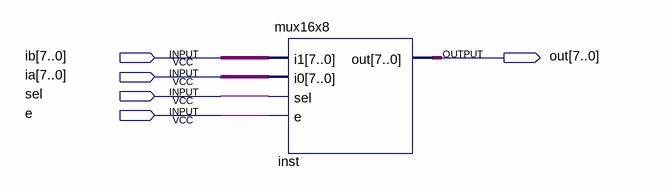
[diagram p0: schematic sheet]
// Quartus schematic Testemux16x8.bdf as structural Verilog: 1 symbols, 5 pins
module Testemux16x8 (
  input  [7:0] ib,
  input  [7:0] ia,
  input  sel,
  input  e,
  output [7:0] out
);

  mux16x8 inst (.i1(ib), .i0(ia), .sel(sel), .e(e), .out(out));
endmodule
